# Altium schematic sheet Power.SchDoc
size A4
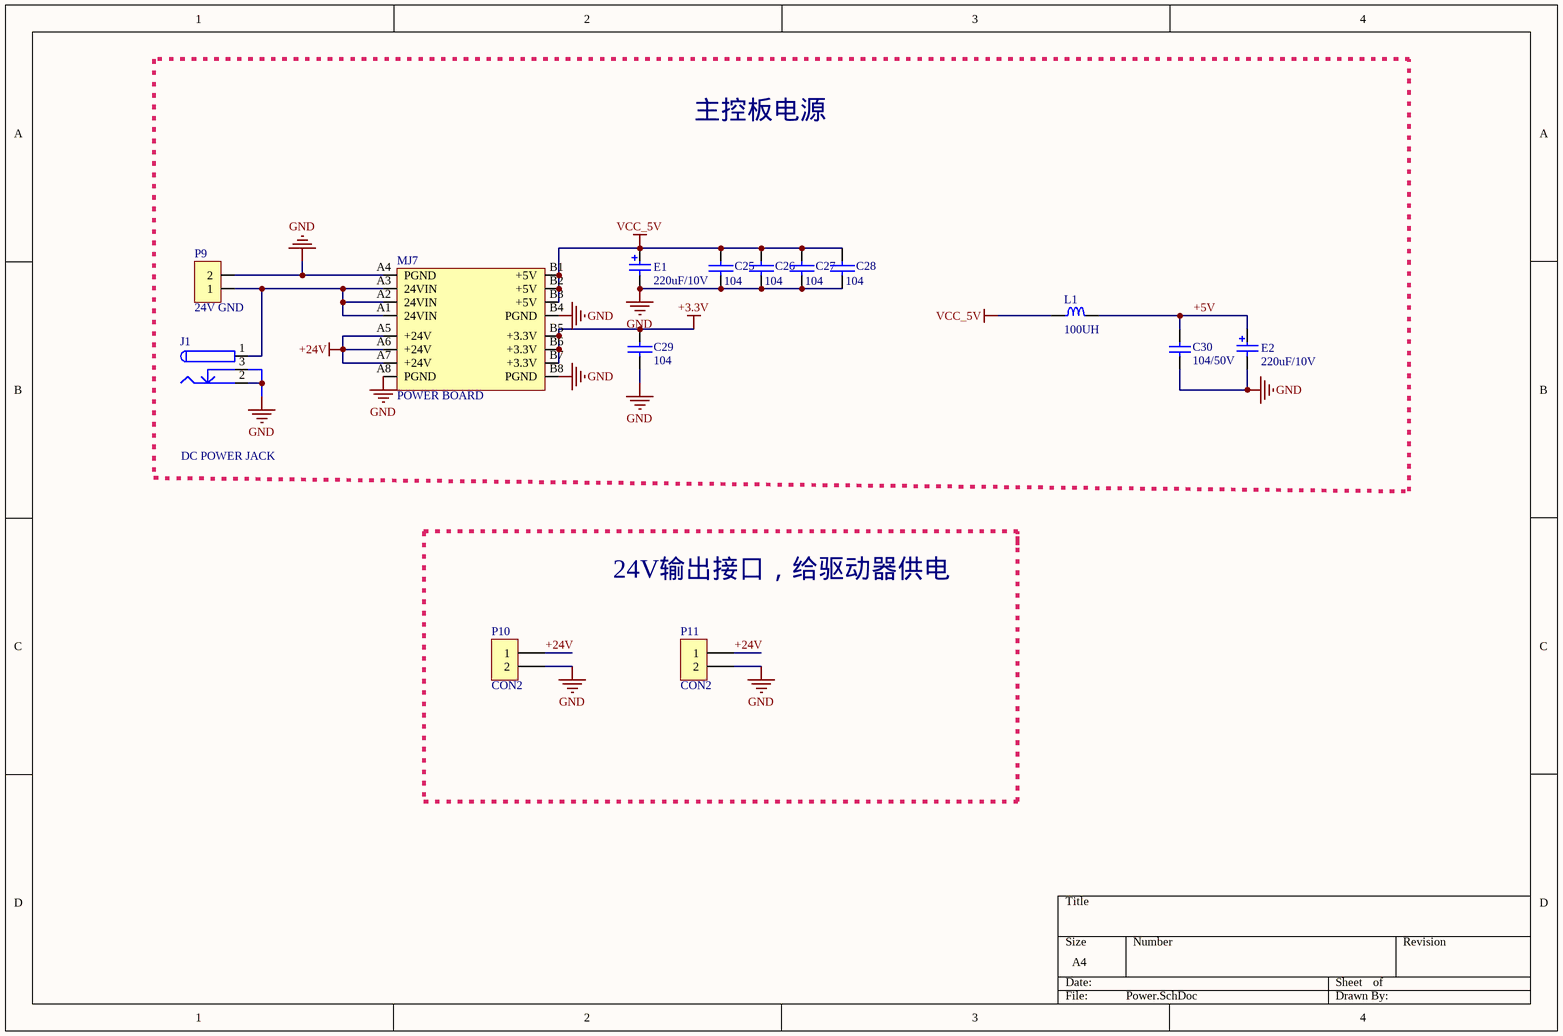
[diagram p0: Power.SchDoc]

## Parts
C25  104  [0603C]
C26  104  [0603C]
C27  104  [0603C]
C28  104  [0603C]
C29  104  [0603C]
C30  104/50V  [0603C]
E1  220uF/10V  [3216]
E2  220uF/10V  [3216]
J1  DC POWER JACK  [DC-005]
L1  100UH  [L-SMD7.4*7.4]
MJ7  POWER BOARD  [POWER BOARD]
P9  24V GND  [KF124-2P-3.5]
P10  CON2  [KF124-2P-3.5]
P11  CON2  [KF124-2P-3.5]

## Blocks framed on the sheet
主控板电源: C25-C30 E1 E2 J1 L1 MJ7 P9

## Nets
+3.3V: C29.2 MJ7.B5(+3.3V) MJ7.B6(+3.3V) MJ7.B7(+3.3V)
+24V: MJ7.A5(+24V) MJ7.A6(+24V) MJ7.A7(+24V) P10.1 P11.1
GND: C25.2 C26.2 C27.2 C28.2 C29.1 C30.1 E1.2 E2.2 J1.2 J1.3 MJ7.A4(PGND) MJ7.A8(PGND) MJ7.B4(PGND) MJ7.B8(PGND) P9.2 P10.2 P11.2
VCC_5V: C25.1 C26.1 C27.1 C28.1 E1.1 L1.1 MJ7.B1(+5V) MJ7.B2(+5V) MJ7.B3(+5V)
+5V: C30.2 E2.1 L1.2
NetJ1_1: J1.1 MJ7.A1(24VIN) MJ7.A2(24VIN) MJ7.A3(24VIN) P9.1

## Notes on the sheet
- 24V输出接口，给驱动器供电

## Library data of the parts
C25-C28 = CAP: Capacitor
C29 = CAP
C30 = C10uF/50V-0805: 瓷片电容,10uF,5%,X7R,50V,0805; 料号: 10201-10053-00; 品名: 瓷片电容
E1 E2 = 电解电容: Bi-Polar Capacitor; Value: 220uF/10V
L1 = INDUCTOR: 电感
MJ7 = J-PW
P9 = KF127-5.08-2P: 欧式接线端子，KF127-5.08-2P,2PIN，5.08mm; 料号: 10701-00036-00; 品名: 线对板连接器